# EAGLE design DoseManager (EAGLE 6.3)
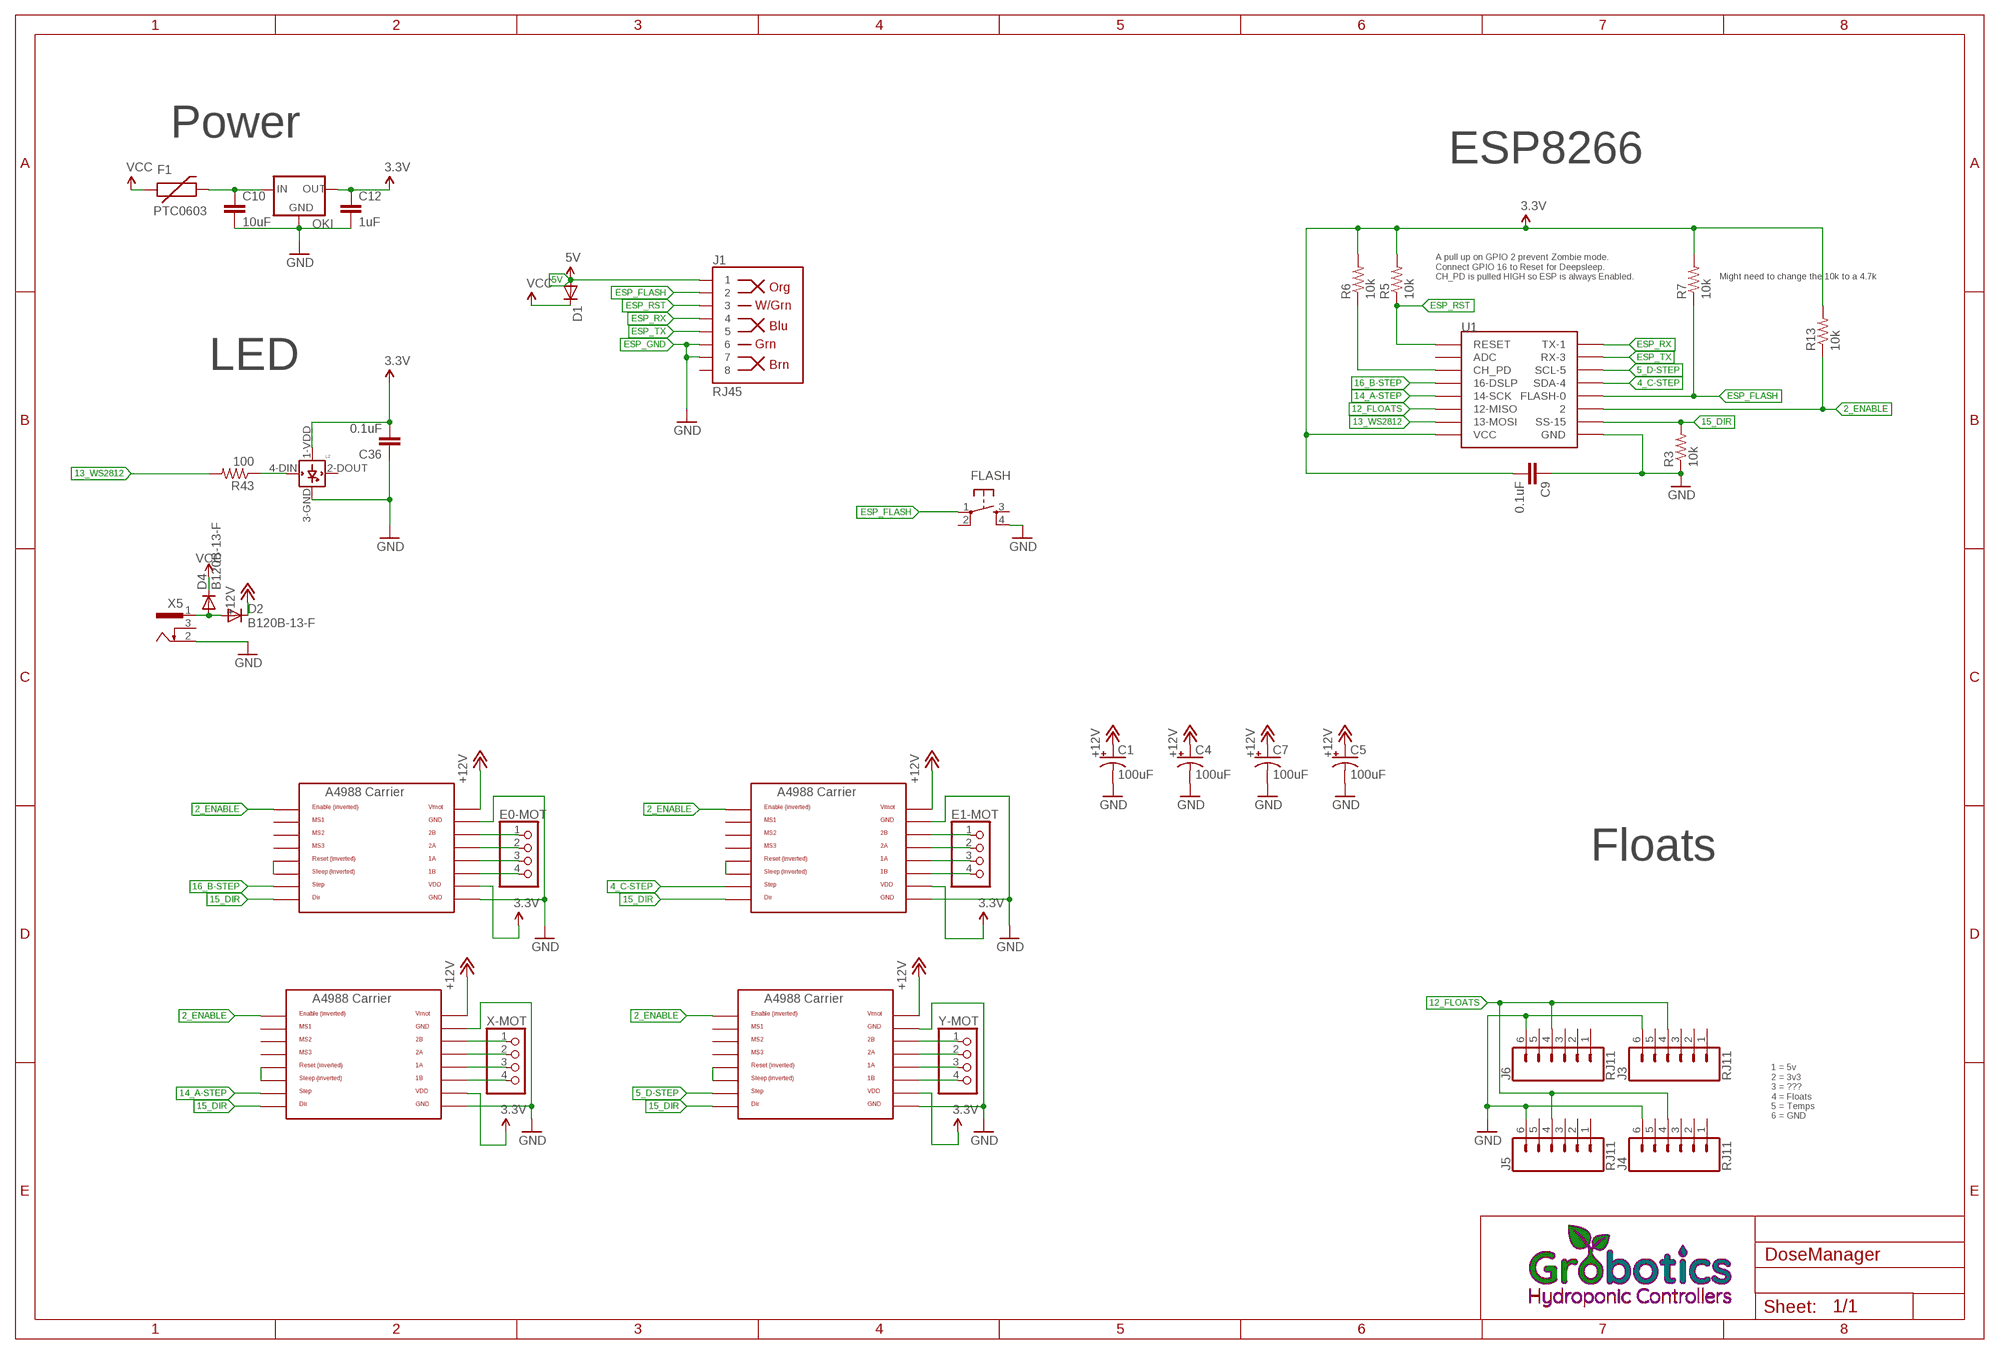
[diagram p0: schematic, sheet 1]

## Parts
C1  100uF  CPOL-US153CLV-0605  [153CLV-0605]
C4  100uF  CPOL-US153CLV-0605  [153CLV-0605]
C5  100uF  CPOL-US153CLV-0605  [153CLV-0605]
C7  100uF  CPOL-US153CLV-0605  [153CLV-0605]
C9  0.1uF  CAP0805  [0805]
C10  10uF  CAP1206  [1206]
C12  1uF  CAP0805  [0805]
C36  0.1uF  CAP0805  [0805]
D1  DIODESOD  [SOD-323]
D2  B120B-13-F  DIODESMB  [SMB-DIODE]
D4  B120B-13-F  DIODESMB  [SMB-DIODE]
E0-MOT  PINHD-1X4  [1X04]
E1-MOT  PINHD-1X4  [1X04]
F1  PTC0603  [0603]
FLASH  TAC_SWITCHSMD  [TACTILE_SWITCH_SMD]
J1  RJ45  RJ45-8  [RJ45-8]
J3  RJ11  RJ11-6  [RJ11-6]
J4  RJ11  RJ11-6  [RJ11-6]
J5  RJ11  RJ11-6  [RJ11-6]
J6  RJ11  RJ11-6  [RJ11-6]
L2  WS2812B  [WS2812B]
OKI  78XXS  [78XXS]
R3  10k  RESISTOR0805  [0805]
R5  10k  RESISTOR0805  [0805]
R6  10k  RESISTOR0805  [0805]
R7  10k  RESISTOR0805  [0805]
R13  10k  RESISTOR0805  [0805]
R43  100  RESISTOR0805  [0805]
U1  ESP12SMD  [ESP12-SMD]
U$1  A4988BREAKOUT  [A4988BREAKOUT]
U$2  LOGO_GROBOTICS-S  [GROBOTICS-S]
U$5  A4988BREAKOUT  [A4988BREAKOUT]
U$6  A4988BREAKOUT  [A4988BREAKOUT]
U$7  A4988BREAKOUT  [A4988BREAKOUT]
X5  733980-62  [733980-62]
X-MOT  PINHD-1X4  [1X04]
Y-MOT  PINHD-1X4  [1X04]

## Nets
2_ENABLE: R13.1 U1.GPIO2 U$1.EN U$5.EN U$6.EN U$7.EN
4_C-STEP: U1.GPIO4(SDA-4) U$5.STEP
5_D-STEP: U1.GPIO5(SCL-5) U$7.STEP
5V: D1.2(A) J1.1
12_FLOATS: J3.4 J4.4 J5.4 J6.4 U1.GPIO12(12-MISO)
13_WS2812: R43.2 U1.GPIO13(13-MOSI)
14_A-STEP: U1.GPIO14(14-SCK) U$6.STEP
15_DIR: R3.2 U1.GPIO15(SS-15) U$1.DIR U$5.DIR U$6.DIR U$7.DIR
16_B-STEP: U1.GPIO16(16-DSLP) U$1.STEP
+12V: C1.+ C4.+ C5.+ C7.+ D2.C U$1.VMOT U$5.VMOT U$6.VMOT U$7.VMOT
ESP_3.3V: C9.2 C12.1 C36.2 L2.1-VDD(VDD) OKI.OUT R5.2 R6.2 R7.2 R13.2 U1.VCC U$1.VDD U$5.VDD U$6.VDD U$7.VDD ; supply symbol labelled 3.3V
ESP_FLASH: FLASH.1 J1.2 R7.1 U1.GPIO0(FLASH-0)
ESP_GND: C1.- C4.- C5.- C7.- C9.1 C10.2 C12.2 C36.1 FLASH.4 J1.6 J1.7 J3.6 J4.6 J5.6 J6.6 L2.3-GND(GND) OKI.GND R3.1 U1.GND U$1.GND U$1.GND@0(GND) U$5.GND U$5.GND@0(GND) U$6.GND U$6.GND@0(GND) U$7.GND U$7.GND@0(GND) X5.2 ; supply symbol labelled GND
ESP_RST: J1.3 R5.1 U1.RESET
ESP_RX: J1.4 U1.TXD0(TX-1)
ESP_TX: J1.5 U1.RXD0(RX-3)
N$1: R6.1 U1.CH_PD
N$3: D2.A D4.A X5.1
N$9: U$1.RST U$1.SLP(SLEEP)
N$18: E0-MOT.1 U$1.2B
N$20: U$6.RST U$6.SLP(SLEEP)
N$21: E0-MOT.2 U$1.2A
N$22: E0-MOT.3 U$1.1A
N$23: U$7.RST U$7.SLP(SLEEP)
N$24: U$5.RST U$5.SLP(SLEEP)
N$26: E0-MOT.4 U$1.1B
N$27: E1-MOT.1 U$5.2B
N$28: E1-MOT.2 U$5.2A
N$32: E1-MOT.3 U$5.1A
N$36: E1-MOT.4 U$5.1B
N$37: U$6.2B X-MOT.1
N$38: U$6.2A X-MOT.2
N$39: U$6.1A X-MOT.3
N$40: U$6.1B X-MOT.4
N$41: U$7.2B Y-MOT.1
N$42: U$7.2A Y-MOT.2
N$43: U$7.1A Y-MOT.3
N$44: U$7.1B Y-MOT.4
N$45: C10.1 F1.2 OKI.IN
N$74: L2.4-DIN(DIN) R43.1
VCC: D1.1(C) D4.C F1.1
Unconnected: FLASH.2 FLASH.3 J1.8 J3.1 J3.2 J3.3 J3.5 J4.1 J4.2 J4.3 J4.5 J5.1 J5.2 J5.3 J5.5 J6.1 J6.2 J6.3 J6.5 L2.2-DOUT(DOUT) U1.ADC U$1.MS1 U$1.MS2 U$1.MS3 U$5.MS1 U$5.MS2 U$5.MS3 U$6.MS1 U$6.MS2 U$6.MS3 U$7.MS1 U$7.MS2 U$7.MS3 X5.3

## Notes on the sheet
- Power
- ESP8266
- A pull up on GPIO 2 prevent Zombie mode.
  Connect GPIO 16 to Reset for Deepsleep.
  CH_PD is pulled HIGH so ESP is always Enabled.
- Might need to change the 10k to a 4.7k
- LED
- Stepper Drivers
- E0 | E1
- Floats
- X | Y | Z
- 1 = 5v
  2 = 3v3
  3 = ???
  4 = Floats
  5 = Temps
  6 = GND

## Library data of the parts
C1 C4 C5 C7 = adafruit:CPOL-US: POLARIZED CAPACITOR, American symbol
C9 C10 C12 C36 = SparkFun-Capacitors:CAP: Capacitor Standard 0603 ceramic capacitor, and 0.1" leaded capacitor.
D1 D2 D4 = SparkFun-DiscreteSemi:DIODE: Diode These are standard reverse protection diodes and small signal diodes. SMA package can handle up to about 1A. SOD-323 can handle about 200mA. What the SOD-323 package when ordering, there are some mfgs out there that are 5-pin packages.
E0-MOT E1-MOT X-MOT Y-MOT = RepRapjr:PINHD-1X4: PIN HEADER
F1 = SparkFun-PowerIC:PTC: Resettable Fuse PTC Resettable Fuse. Spark Fun Electronics SKU : COM-08357
FLASH = SparkFun-Electromechanical:TAC_SWITCH: Momentary Switch Button commonly used for reset or general input. Spark Fun Electronics SKU : COM-00097 SMT- SWCH-08247; PROD_ID: SWCH-08247
J1 = SparkFun-Connectors:RJ45-8: RJ45 Jack - 8 pin Simple RJ45, 8-pin connection. Commonly used for Cat5, Cat5e, and Cat6 Ethernet cables. Here is the connector we sell at SparkFun: RJ45 8-Pin Connector <https://www.sparkfun.com/products/643> (PRT-00643) Datasheet <https://cdn.sparkfun.com/datasheets/Prototyping/04908.pdf> It is used on this SparkFun product: SparkFun RJ45 Breakout <https://www.sparkfun.com/products/716> (BOB-00716) Note, you may also be interested in the "MAGJACK" version of this. It is basically a RJ45 connector, but also has some status LEDs built into the connector housing. You can check that out in this library at the device named "MAGJACK.dev" and see these products online: RJ45 Ethernet MagJack-Compatible <https://www.sparkfun.com/products/8534> (PRT-08534) SparkFun RJ45 MagJack Breakout <https://www.sparkfun.com/products/13021> (BOB-13021); PROD_ID: CONN-08506; SF_ID: PRT-00643
J3-J6 = SparkFun-Connectors:RJ11-6: RJ11 Jack - 6 pin Commonly found on CAT3 devices and some Microchip programmers. Here is the connector we sell at SparkFun: RJ11 6-Pin Connector <https://www.sparkfun.com/products/132> (PRT-00132) Datasheet <http://www.sparkfun.com/datasheets/Prototyping/Connectors/RJ11-Datasheet.pdf> It is used on this SparkFun product: SparkFun Weather Shield <https://www.sparkfun.com/products/12081> (DEV-12081) Weather Meters <https://www.sparkfun.com/products/8942> (SEN-08942); PROD_ID: CONN-08590; SF_ID: PRT-00132
L2 = adafruit:WS2812B
OKI = v-reg:78XXS: VOLTAGE REGULATOR
R3 R5-R7 R13 R43 = LowPowerLab:RESISTOR: Resistor Basic schematic elements and footprints for 0603, 1206, and PTH resistors.
U1 = esp8266modules:ESP12: ESP8266 Wifi module 12
U$1 U$5-U$7 = RepRapjr:A4988BREAKOUT
U$2 = 1_Skips:LOGO_GROBOTICS-S
X5 = con-conrad:73398?: FEMALE PRINT CONNECTOR Niedervolt-Steckverbinder Distributor Conrad

## Net classes
1 power: width 0.381 mm, clearance 0.254 mm

## Board
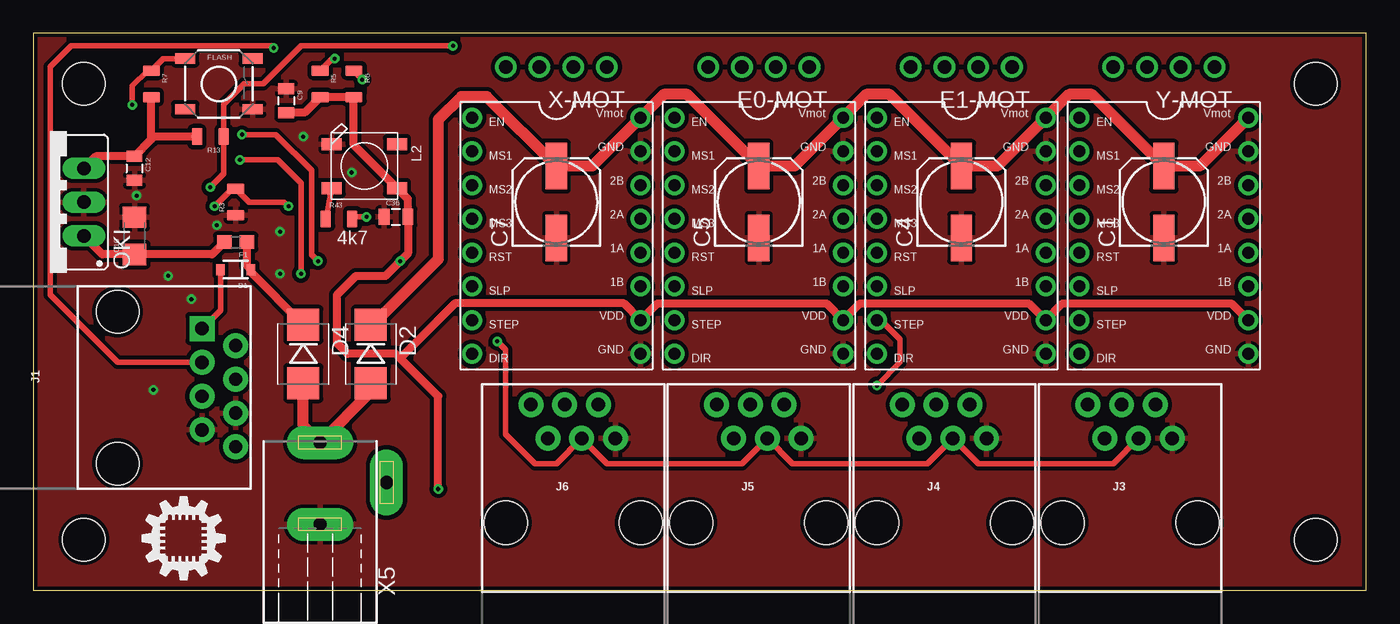
[diagram p1: board, top side]
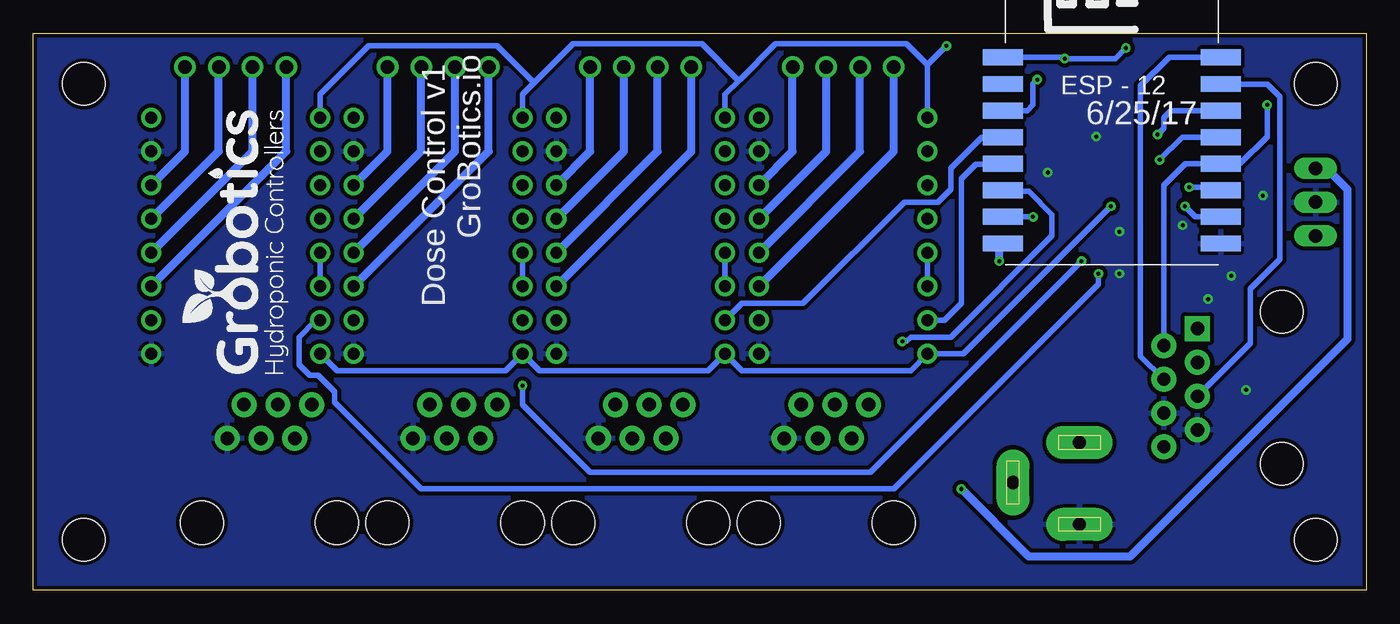
[diagram p2: board, bottom side, seen from below]

Size 100.33 x 41.91 mm. Coordinates in mm from the lower left corner, seen from the top.
Outline: 0,0 100.33,0 100.33,41.91 0,41.91 0,0
Copper layers (1*16): Top 0.035mm / dielectric 1.5mm / Bottom 0.035mm
Design rules "DFRobot_Eagle_Rule_v0.4": minimum track width 6mil, minimum drill 12mil, track to track 6mil, track to pad 6mil, pad to pad 6mil, via to via 6mil, smd to smd 0mil, copper to edge 10mil, drill to drill 10mil, minimum pad ring 12mil, minimum via ring 8mil, stop-mask expansion 2mil, vias tented up to drill 25mil, thermal gap 10mil
Holes 3.2 mm at 3.81,3.81 96.52,3.81 96.52,38.1 3.81,38.1

### Footprints (pad centres in the part's own frame; a part is rotated, then mirrored left to right if it is on the bottom)
153CLV-0605 = smd 3.5 x 1.6: + 2.7,0; - -2.7,0
0805 = smd 0.8 x 1.2: 1 -0.9,0; 2 0.9,0
1206 = smd 1.6 x 1.8: 1 -1.4,0; 2 1.4,0
SOD-323 = smd 0.63 x 0.83: 1 -1.15,0; 2 1.15,0
SMB-DIODE = smd 2.4 x 2.4: A 2.2,0; C -2.2,0
1X04 = drill 1.016: 1 -2.54,0; 2 0,0; 3 2.54,0; 4 5.08,0
0603 = smd 1.1 x 1: 1 -0.85,0; 2 0.85,0
TACTILE_SWITCH_SMD = smd 1.524 x 0.762: 1 -2.54,1.905; 2 2.54,1.905; 3 -2.54,-1.905; 4 2.54,-1.905
RJ45-8 = drill 1 pad 1.88 square: 1 -4.445,6.35 | drill 1 pad 1.88: 2 -3.175,8.89; 3 -1.905,6.35; 4 -0.635,8.89; 5 0.635,6.35; 6 1.905,8.89; 7 3.175,6.35; 8 4.445,8.89 | hole 3.2: -5.715,0; 5.715,0
RJ11-6 = drill 1.016 pad 1.88: 1 -3.175,8.89; 2 -1.905,6.35; 3 -0.635,8.89; 4 0.635,6.35; 5 1.905,8.89; 6 3.175,6.35 | hole 3.251: -5.08,0; 5.08,0
WS2812B = smd 1.5 x 0.9: 1-VDD 2.45,-1.65; 2-DOUT 2.45,1.65; 3-GND -2.45,1.65; 4-DIN -2.45,-1.65
78XXS = drill 1.016 long: GND 0,-2.54; IN -2.54,-2.54; OUT 2.54,-2.54
0805' = smd 0.8 x 1.3: 1 -1,0; 2 1,0
ESP12-SMD = smd 3 x 1.2: ADC -8.3,3.8; CH_PD -8.3,1.8; GND 8.1,-8.2; GPIO0 8.1,-2.2; GPIO2 8.1,-4.2; GPIO4 8.1,1.8; GPIO5 8.1,-0.2; GPIO12 -8.3,-4.2; GPIO13 -8.3,-6.2; GPIO14 -8.3,-2.2; GPIO15 8.1,-6.2; GPIO16 -8.3,-0.2; RESET -8.3,5.8; RXD0 8.1,3.8; TXD0 8.1,5.8; VCC -8.3,-8.2
A4988BREAKOUT = drill 0.9: 1A 8.89,1.27; 1B 11.43,1.27; 2A 6.35,1.27; 2B 3.81,1.27; DIR 16.51,-11.43; EN -1.27,-11.43; GND 16.51,1.27; GND@0 1.27,1.27; MS1 1.27,-11.43; MS2 3.81,-11.43; MS3 6.35,-11.43; RST 8.89,-11.43; SLP 11.43,-11.43; STEP 13.97,-11.43; VDD 13.97,1.27; VMOT -1.27,1.27
733980-62 = drill 1 pad 2.5 long: 1 0,8.57; 2 0,2.42; 3 5,5.57

### Placement (x,y rotation side)
C1  85.09,29.21 90 top
C4  69.85,29.21 90 top
C5  54.61,29.21 90 top
C7  39.37,29.21 90 top
C9  19.05,36.83 270 top
C10  7.62,26.67 90 top
C12  7.62,31.75 270 top
C36  27.3,28.1 0 top
D1  15.24,24.13 180 top
D2  25.4,17.78 270 top
D4  20.32,17.78 270 top
E0-MOT  55.88,39.37 180 top
E1-MOT  71.12,39.37 180 top
F1  15.24,26.19 180 top
FLASH  13.97,38.1 0 top
J1  6.35,15.24 270 top
J3  82.55,5.08 0 top
J4  68.58,5.08 0 top
J5  54.61,5.08 0 top
J6  40.64,5.08 0 top
L2  24.92,31.91 0 top
OKI  1.27,29.21 90 top
R3  10k  [0805']  15.24,29.21 90 top
R5  10k  [0805']  21.59,38.1 270 top
R6  10k  [0805']  24.13,38.1 270 top
R7  10k  [0805']  8.89,38.1 270 top
R13  10k  [0805']  13.34,34.13 180 top
R43  100  [0805']  23.02,27.94 0 top
U1  19.05,34.29 0 bottom
U$1  59.69,34.29 270 top
U$2  81.12,16.03 90 bottom
U$5  74.93,34.29 270 top
U$6  44.45,34.29 270 top
U$7  90.17,34.29 270 top
U$20  [ID_LOGO_X0.25]  8.1,0.64 0 top
X5  21.59,2.54 0 top
X-MOT  40.64,39.37 180 top
Y-MOT  86.36,39.37 180 top

### Tracks (layer width: path | path; a pad name or v marks a point on that pad's centre or on a via)
2_ENABLE  (via drill 0.3)
  Top 0.406: v31.59,40.96 20.16,40.96 17.3,38.1 15.88,38.1 14.34,36.56 R13.1 14.34,31.32 v13.34,30.32
  Bottom 0.406: U1.GPIO2 11.18,30.32 v13.34,30.32 | U$6.EN 33.02,39.53 | 33.02,39.53 34.61,41.12 44.45,41.12 47.15,38.42 | 47.15,38.42 48.26,37.31 U$1.EN | U$5.EN 63.5,37.31 62.71,38.1 | 62.71,38.1 59.69,41.12 50.01,41.12 47.31,38.42 47.15,38.42 | U$7.EN 78.74,37.31 75.09,40.96 65.41,40.96 62.71,38.26 62.71,38.1 | v31.59,40.96 33.02,39.53
4_C-STEP  (via drill 0.3)
  Top 0.406: v15.72,34.29 18.26,34.29 20.95,31.59 20.95,25.24 v21.43,24.77 | v63.5,15.4 65.25,17.14 65.25,18.89 63.82,20.32 U$5.STEP
  Bottom 0.406: U1.GPIO4 14.71,36.09 15.24,35.56 15.24,34.77 v15.72,34.29 | v21.43,24.77 37.31,8.89 58.42,8.89 63.5,13.97 v63.5,15.4
5_D-STEP  (via drill 0.3)
  Top 0.406: v15.56,32.38 18.41,32.38 20.16,30.64 v20.16,23.81
  Bottom 0.406: U1.GPIO5 13.85,34.09 v15.56,32.38 | v20.16,23.81 20.16,23.02 35.56,7.62 71.12,7.62 77.63,14.13 77.63,14.92 78.9,16.19 79.53,16.19 80.33,16.99 80.33,19.05 79.06,20.32 U$7.STEP
5V
  Top 0.406: J1.1 14.09,21.07 D1.2
12_FLOATS  (via drill 0.3)
  Top 0.406: J3.4 81.28,9.53 71.12,9.53 J4.4 67.31,9.53 57.15,9.53 J5.4 53.34,9.53 43.18,9.53 J6.4 39.37,9.53 37.78,9.53 35.56,11.75 35.56,18.1 v34.92,18.73
  Bottom 0.406: U1.GPIO12 27.26,30 25.4,30 23.65,28.26 23.65,26.67 31.27,19.05 34.29,19.05 34.61,18.73 v34.92,18.73
13_WS2812  (via drill 0.3)
  Top 0.406: v25.08,28.1 23.86,28.1 R43.2
  Bottom 0.406: U1.GPIO13 v25.08,28.09 v25.08,28.1
14_A-STEP
  Bottom 0.406: U$6.STEP 31.75,20.32 30.48,21.59 30.48,30.96 29.37,32.07 27.37,32.07 U1.GPIO14
15_DIR  (via drill 0.3)
  Top 0.406: v13.65,28.89 14.97,30.21 R3.2 16.24,29.21 18.89,29.21 v19.21,28.89
  Bottom 0.406: U1.GPIO15 12.85,28.09 v13.65,28.89 | v19.21,28.89 30.32,17.78 U$6.DIR 34.29,16.51 46.99,16.51 U$1.DIR 49.53,16.51 62.23,16.51 U$5.DIR 64.77,16.51 77.47,16.51 U$7.DIR
16_B-STEP
  Bottom 0.406: U1.GPIO16 28.93,34.09 31.27,31.75 31.27,30.16 32.23,29.21 34.77,29.21 42.39,21.59 46.99,21.59 U$1.STEP
+12V
  Top 0.813: U$7.VMOT 87.79,31.91 C1.+ 79.69,37.31 77.95,37.31 U$5.VMOT 72.55,31.91 C4.+ 64.45,37.31 62.71,37.31 U$1.VMOT 57.31,31.91 C5.+ 49.21,37.31 47.47,37.31 U$6.VMOT 42.07,31.91 C7.+ 34.13,37.15 32.23,37.15 30.48,35.4 30.48,24.92 25.54,19.98 D2.C
ESP_3.3V  (via drill 0.3)
  Top 0.61: C9.2 20.42,35.93 R5.2 R6.2 24.13,33.5 L2.1-VDD 28.2,29.43 C36.2 28.2,25.35 v27.62,24.77 26.51,23.65 24.29,23.65 22.86,22.23 22.86,18.57 23.65,17.78 27.3,17.78 27.62,17.46 | 8.89,33.92 C12.1 4.71,32.65 OKI.OUT | 8.89,33.92 R7.2 | R13.2 9.1,34.13 8.89,33.92 | v30.48,7.62 30.48,14.61 27.62,17.46 | U$7.VDD 90.17,21.59 77.47,21.59 U$5.VDD 74.93,21.59 62.23,21.59 U$1.VDD 59.69,21.59 46.99,21.59 U$6.VDD 44.45,21.59 31.75,21.59 27.62,17.46
  Bottom 0.61: OKI.OUT 3.02,31.75 1.43,30.16 1.43,18.89 17.78,2.54 25.4,2.54 v30.48,7.62 | v27.62,24.77 27.62,25.82 U1.VCC
ESP_FLASH  (via drill 0.3)
  Top 0.406: 8.46,39.1 R7.1 | R7.1 9.79,40.01 FLASH.1 | v7.46,36.51 7.46,37.94 8.62,39.1 R7.1
  Bottom 0.406: J1.2 15.24,30.48 13.63,32.09 U1.GPIO0 9.5,32.09 7.46,34.13 v7.46,36.51
ESP_GND  (via drill 0.3)
  other vias: 7.78,29.69 10.16,23.65 18.57,26.99 18.57,23.81 11.91,21.91 13.81,27.46 23.97,31.43 20.32,34.13 9.05,15.08
  pour Top (isolate 0.305): 0,0 100.33,0 100.33,41.91 0,41.91
  pour Bottom (isolate 0.305): 0,0 100.33,0 100.33,41.91 0,41.91
ESP_RST  (via drill 0.3)
  Top 0.406: v22.7,40.01 22.5,40.01 R5.1 | J1.3 6.35,17.14 1.27,22.23 1.27,39.37 2.86,40.96 17.94,40.96 v18.1,40.8
  Bottom 0.406: U1.RESET 22.79,40.09 v22.7,40.01 18.89,40.01 v18.1,40.8
ESP_RX
  Bottom 0.406: J1.4 16.99,17.62 16.99,37.94 14.84,40.09 U1.TXD0
ESP_TX
  Bottom 0.406: J1.5 8.73,18.57 8.73,22.7 6.51,24.92 6.51,37.15 7.45,38.09 U1.RXD0
N$1  (via drill 0.3)
  Top 0.406: v24.77,38.42 24.77,38.47 R6.1
  Bottom 0.406: U1.CH_PD 25.5,36.09 25.08,36.51 25.08,38.1 v24.77,38.42
N$3
  Top 0.813: D4.A 20.32,12.38 X5.1 25.4,14.92 D2.A
N$9
  Bottom 0.406: U$1.RST U$1.SLP
N$18
  Bottom 0.61: U$1.2B 58.42,33.02 E0-MOT.1
N$20
  Bottom 0.406: U$6.RST U$6.SLP
N$21
  Bottom 0.61: U$1.2A 55.88,33.02 E0-MOT.2
N$22
  Bottom 0.61: U$1.1A 53.34,33.02 E0-MOT.3
N$23
  Bottom 0.406: U$7.RST U$7.SLP
N$24
  Bottom 0.406: U$5.RST U$5.SLP
N$26
  Bottom 0.61: U$1.1B 50.8,33.02 E0-MOT.4
N$27
  Bottom 0.61: U$5.2B 73.66,33.02 E1-MOT.1
N$28
  Bottom 0.61: U$5.2A 71.12,33.02 E1-MOT.2
N$32
  Bottom 0.61: U$5.1A 68.58,33.02 E1-MOT.3
N$36
  Bottom 0.61: U$5.1B 66.04,33.02 E1-MOT.4
N$37
  Bottom 0.61: U$6.2B 43.18,33.02 X-MOT.1
N$38
  Bottom 0.61: U$6.2A 40.64,33.02 X-MOT.2
N$39
  Bottom 0.61: U$6.1A 38.1,33.02 X-MOT.3
N$40
  Bottom 0.61: U$6.1B 35.56,33.02 X-MOT.4
N$41
  Bottom 0.61: U$7.2B 88.9,33.02 Y-MOT.1
N$42
  Bottom 0.61: U$7.2A 86.36,33.02 Y-MOT.2
N$43
  Bottom 0.61: U$7.1A 83.82,33.02 Y-MOT.3
N$44
  Bottom 0.61: U$7.1B 81.28,33.02 Y-MOT.4
N$45
  Top 0.61: F1.2 13.47,25.27 C10.1 5.21,25.27 OKI.IN
N$74
  Top 0.406: R43.1 22.06,27.94 L2.4-DIN
VCC
  Top 0.61: D4.C 16.39,23.91 D1.1 16.09,24.43 F1.1

### Text on the board
tPlace: 4k7
bPlace: Dose Control v1 / GroBotics.io | 6/25/17